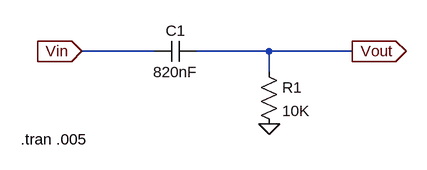
[diagram p0: schematic filter.asc]
filter.asc, the LTspice schematic file:
Version 4
SHEET 1 880 680
WIRE 384 208 272 208
WIRE 560 208 448 208
WIRE 688 208 560 208
WIRE 560 240 560 208
FLAG 560 320 0
FLAG 688 208 Vout
IOPIN 688 208 Out
FLAG 272 208 Vin
IOPIN 272 208 In
SYMBOL cap 448 192 R90
WINDOW 0 0 32 VBottom 2
WINDOW 3 32 32 VTop 2
SYMATTR InstName C1
SYMATTR Value 820nF
SYMBOL res 544 224 R0
SYMATTR InstName R1
SYMATTR Value 10K
TEXT 178 344 Left 2 !.tran .005

The netlist it stands for:
* filter.asc
C1 Vout Vin 820nF
R1 Vout 0 10K
.tran .005
.backanno
.end